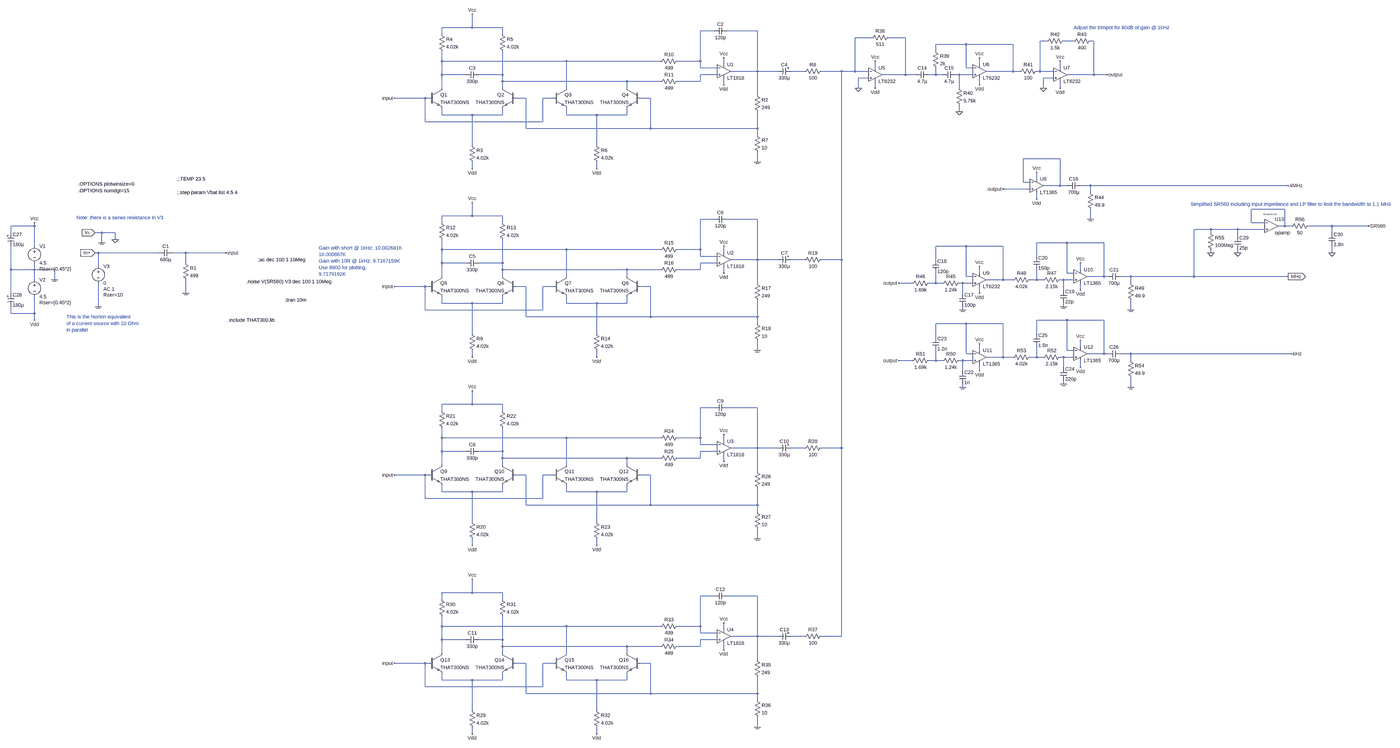
[diagram p0: schematic 60dB-LNA.asc, whole sheet]
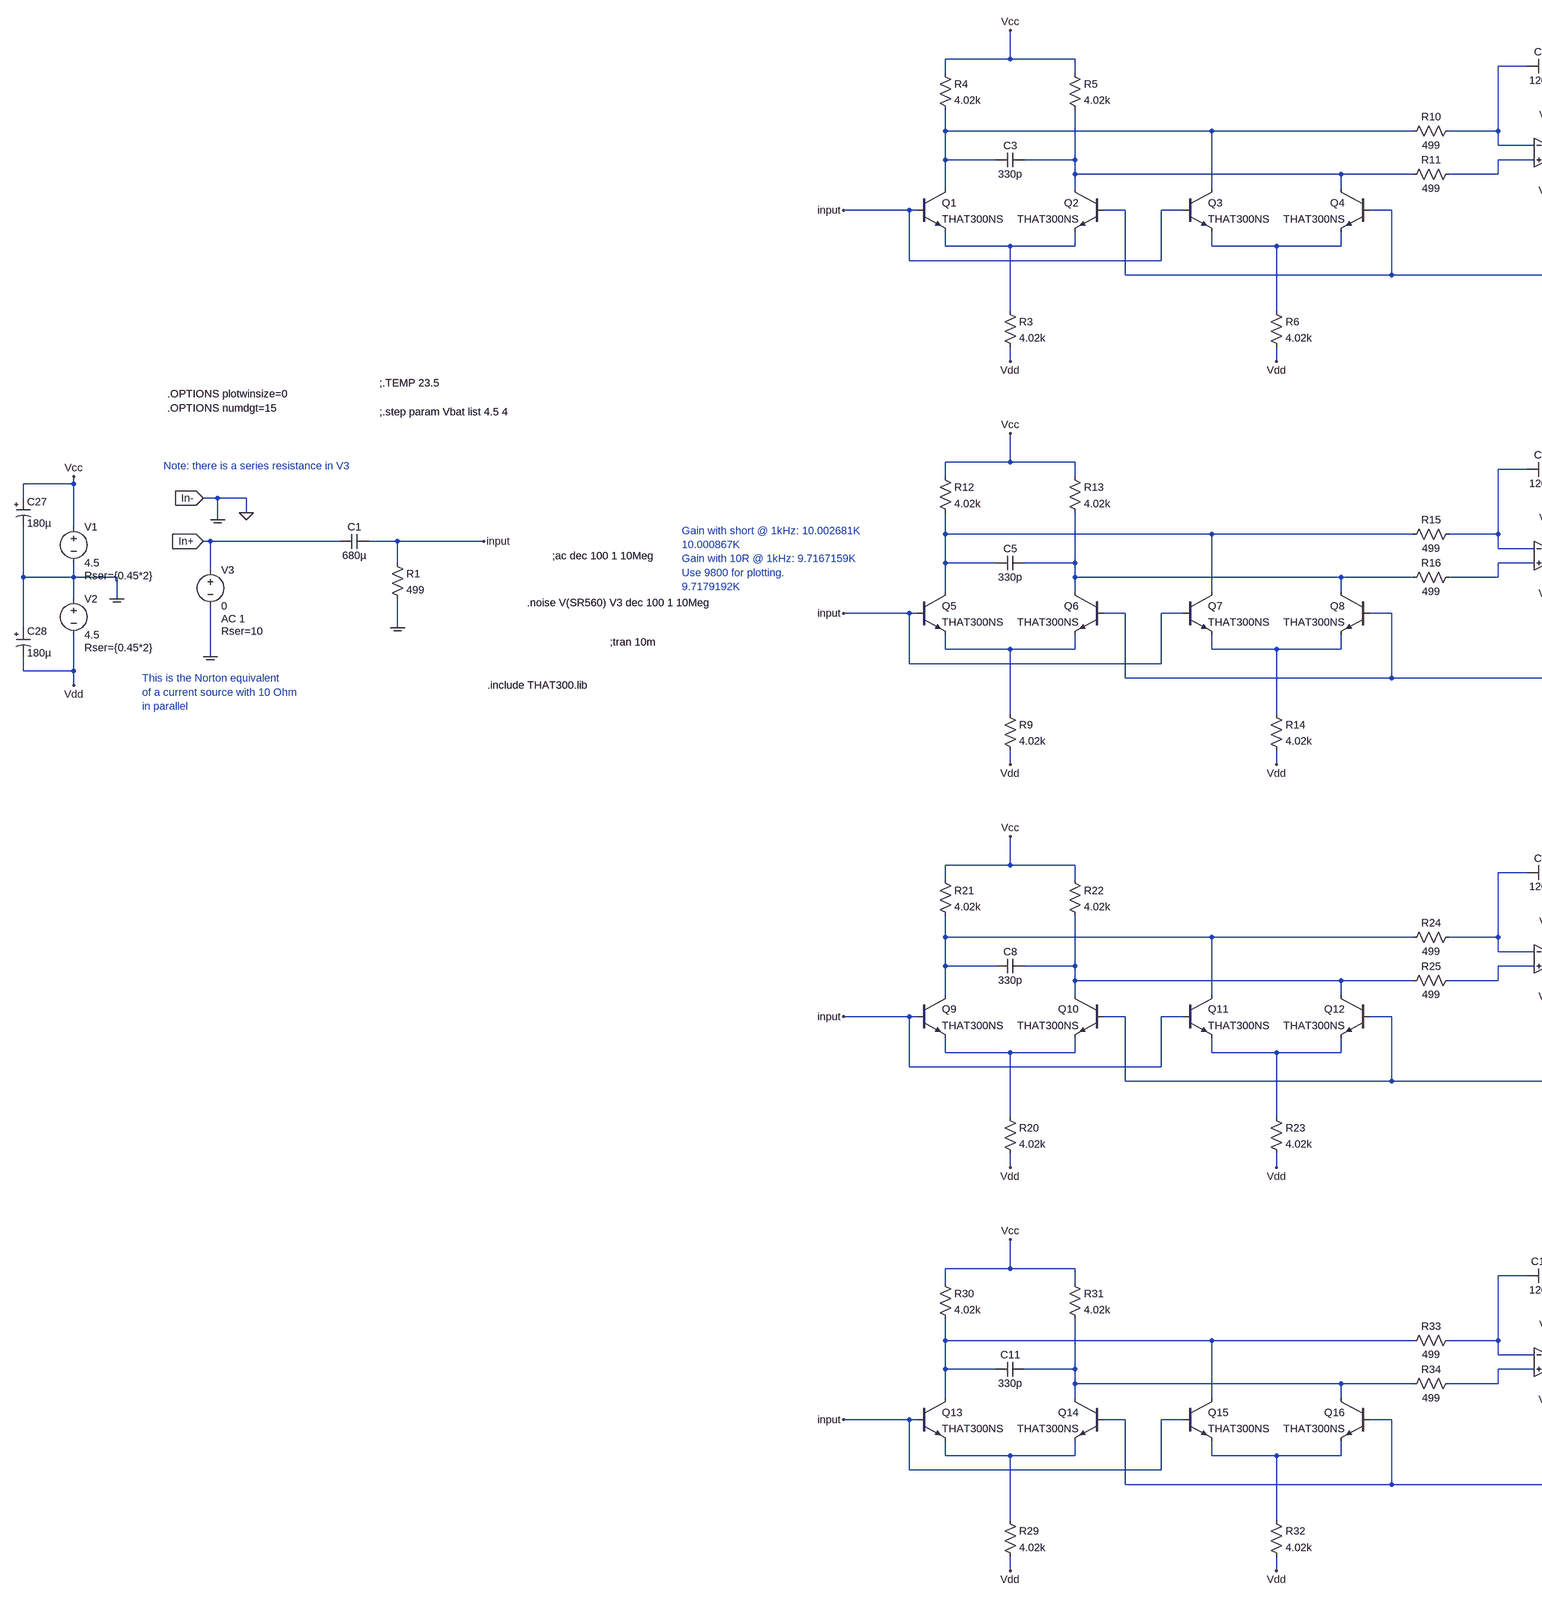
[diagram p1: schematic 60dB-LNA.asc, part, row 1 of 1, column 1 of 2]
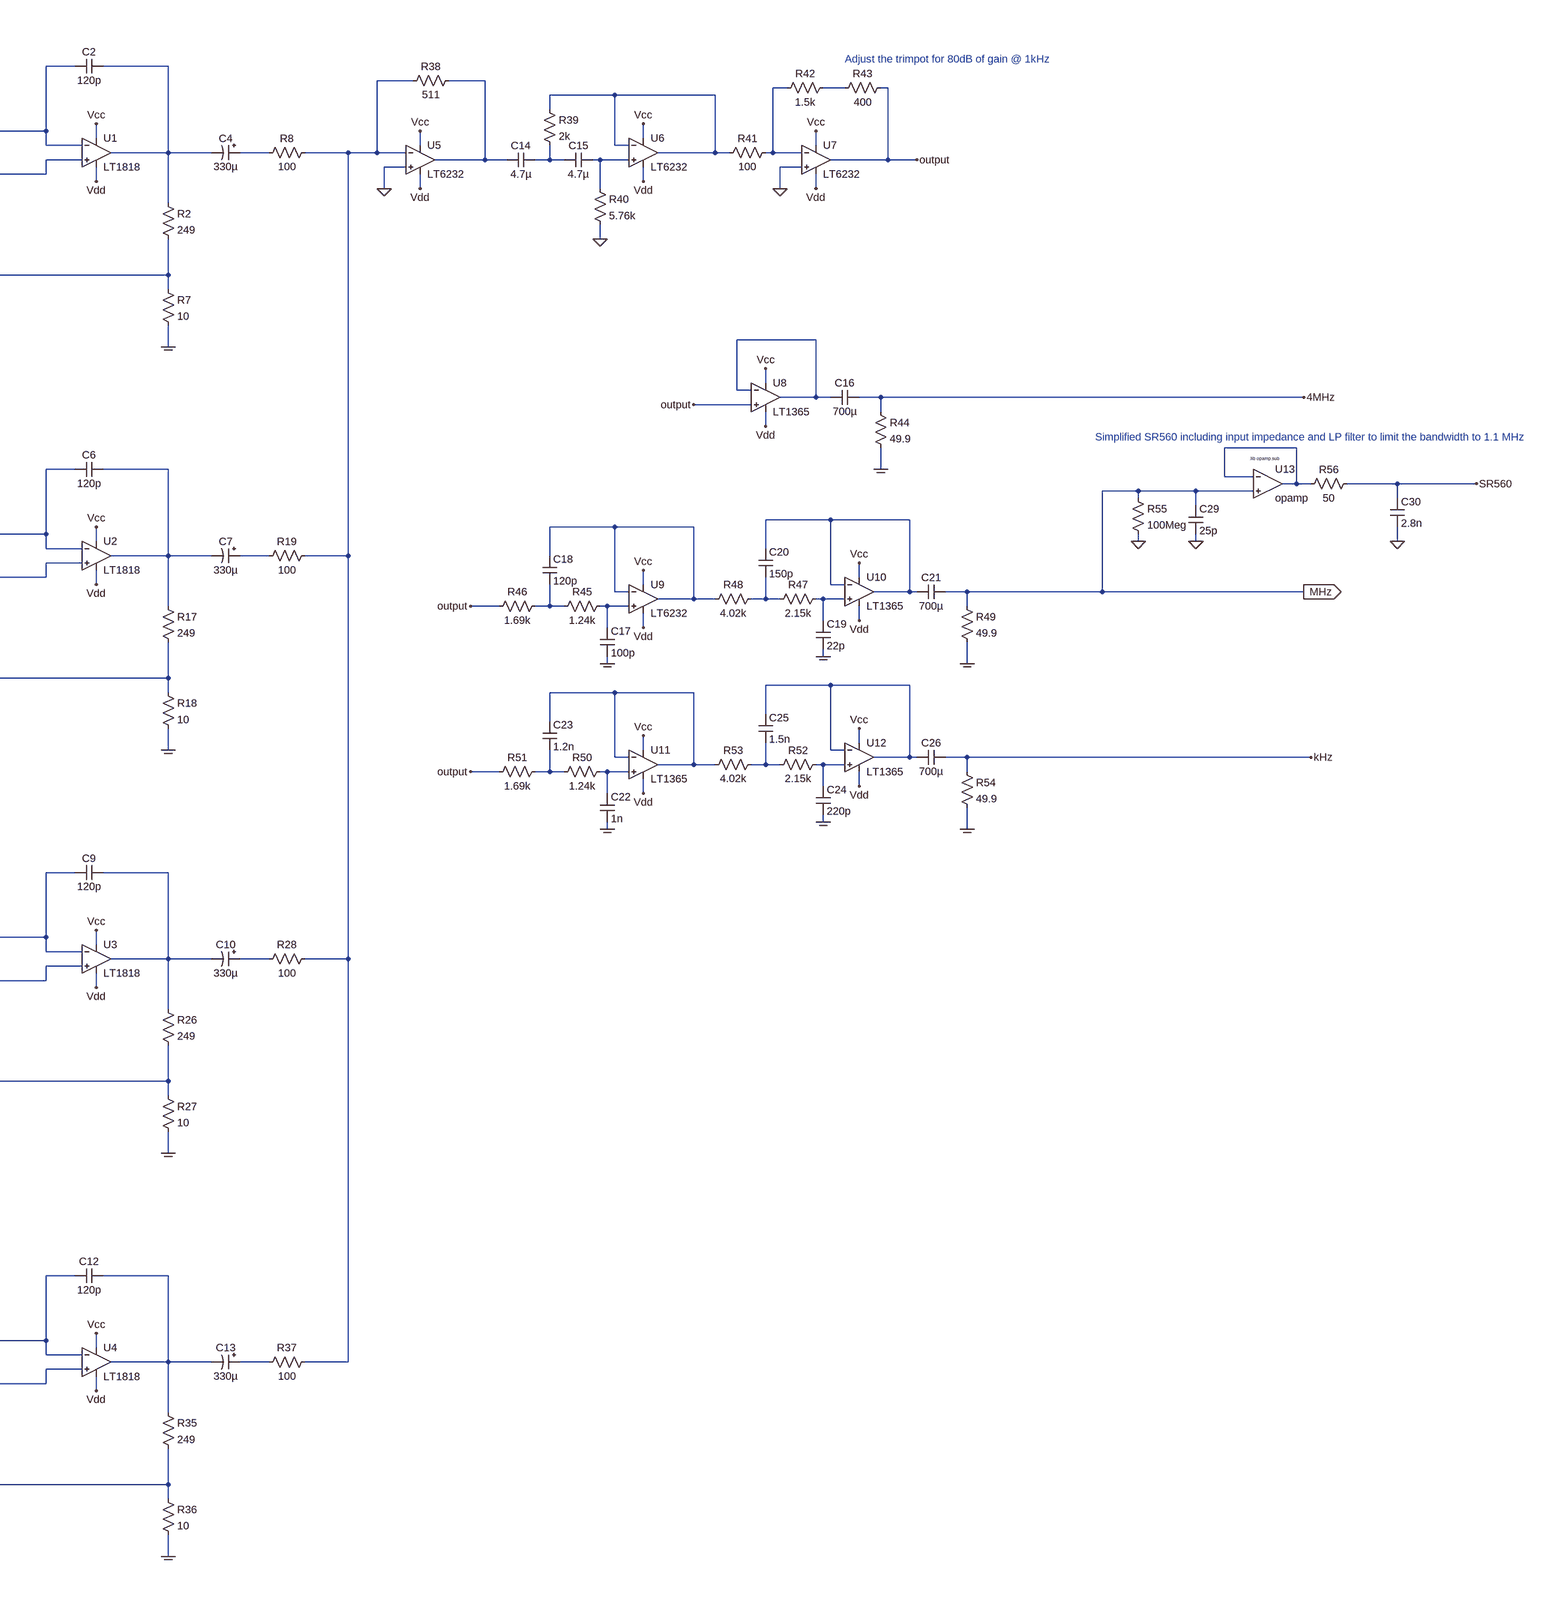
[diagram p2: schematic 60dB-LNA.asc, part, row 1 of 1, column 2 of 2]
60dB-LNA.asc, the LTspice schematic file:
Version 4
SHEET 1 5900 2380
WIRE 1408 -1072 1408 -1136
WIRE 1408 -1072 1264 -1072
WIRE 1552 -1072 1408 -1072
WIRE 2560 -1056 2496 -1056
WIRE 2768 -1056 2624 -1056
WIRE 1264 -1040 1264 -1072
WIRE 1552 -1040 1552 -1072
WIRE 3312 -1024 3232 -1024
WIRE 3472 -1024 3392 -1024
WIRE 4144 -1008 4112 -1008
WIRE 4272 -1008 4224 -1008
WIRE 4368 -1008 4352 -1008
WIRE 3760 -992 3616 -992
WIRE 3984 -992 3760 -992
WIRE 3616 -960 3616 -992
WIRE 1264 -912 1264 -960
WIRE 1856 -912 1264 -912
WIRE 2304 -912 1856 -912
WIRE 2496 -912 2496 -1056
WIRE 2496 -912 2384 -912
WIRE 2608 -896 2608 -928
WIRE 3824 -896 3824 -928
WIRE 2496 -880 2496 -912
WIRE 2576 -880 2496 -880
WIRE 3328 -880 3328 -912
WIRE 3760 -880 3760 -992
WIRE 3792 -880 3760 -880
WIRE 4208 -880 4208 -912
WIRE 2768 -864 2768 -1056
WIRE 2768 -864 2640 -864
WIRE 2864 -864 2768 -864
WIRE 2992 -864 2928 -864
WIRE 3168 -864 3072 -864
WIRE 3232 -864 3232 -1024
WIRE 3232 -864 3168 -864
WIRE 3296 -864 3232 -864
WIRE 3984 -864 3984 -992
WIRE 3984 -864 3856 -864
WIRE 4016 -864 3984 -864
WIRE 4112 -864 4112 -1008
WIRE 4112 -864 4096 -864
WIRE 4176 -864 4112 -864
WIRE 1264 -848 1264 -912
WIRE 1376 -848 1264 -848
WIRE 1552 -848 1552 -960
WIRE 1552 -848 1440 -848
WIRE 2576 -848 2496 -848
WIRE 3472 -848 3472 -1024
WIRE 3472 -848 3360 -848
WIRE 3520 -848 3472 -848
WIRE 3616 -848 3616 -880
WIRE 3616 -848 3584 -848
WIRE 3648 -848 3616 -848
WIRE 3728 -848 3712 -848
WIRE 3792 -848 3728 -848
WIRE 4368 -848 4368 -1008
WIRE 4368 -848 4240 -848
WIRE 4432 -848 4368 -848
WIRE 3296 -832 3248 -832
WIRE 4176 -832 4128 -832
WIRE 1552 -816 1552 -848
WIRE 2144 -816 1552 -816
WIRE 2304 -816 2144 -816
WIRE 2496 -816 2496 -848
WIRE 2496 -816 2384 -816
WIRE 2608 -800 2608 -832
WIRE 3824 -800 3824 -832
WIRE 1264 -784 1264 -848
WIRE 1552 -784 1552 -816
WIRE 1856 -784 1856 -912
WIRE 2144 -784 2144 -816
WIRE 3248 -784 3248 -832
WIRE 3328 -784 3328 -816
WIRE 3728 -784 3728 -848
WIRE 4128 -784 4128 -832
WIRE 4208 -784 4208 -816
WIRE 2768 -752 2768 -864
WIRE 1184 -736 976 -736
WIRE 1200 -736 1184 -736
WIRE 1664 -736 1616 -736
WIRE 1792 -736 1744 -736
WIRE 2256 -736 2208 -736
WIRE 3728 -672 3728 -704
WIRE 1264 -656 1264 -688
WIRE 1408 -656 1264 -656
WIRE 1552 -656 1552 -688
WIRE 1552 -656 1408 -656
WIRE 1856 -656 1856 -688
WIRE 2000 -656 1856 -656
WIRE 2144 -656 2144 -688
WIRE 2144 -656 2000 -656
WIRE 1184 -624 1184 -736
WIRE 1744 -624 1744 -736
WIRE 1744 -624 1184 -624
WIRE 1664 -592 1664 -736
WIRE 2256 -592 2256 -736
WIRE 2256 -592 1664 -592
WIRE 2768 -592 2768 -672
WIRE 2768 -592 2256 -592
WIRE 2768 -560 2768 -592
WIRE 1408 -512 1408 -656
WIRE 2000 -512 2000 -656
WIRE 4208 -448 4032 -448
WIRE 2768 -432 2768 -480
WIRE 1408 -400 1408 -432
WIRE 2000 -400 2000 -432
WIRE 4096 -352 4096 -384
WIRE 4032 -336 4032 -448
WIRE 4064 -336 4032 -336
WIRE 4208 -320 4208 -448
WIRE 4208 -320 4128 -320
WIRE 4240 -320 4208 -320
WIRE 4352 -320 4304 -320
WIRE 5344 -320 4352 -320
WIRE 4064 -304 3936 -304
WIRE 4352 -288 4352 -320
WIRE 4096 -256 4096 -288
WIRE 5328 -208 5168 -208
WIRE 1408 -176 1408 -240
WIRE 1408 -176 1264 -176
WIRE 1552 -176 1408 -176
WIRE 2560 -160 2496 -160
WIRE 2768 -160 2624 -160
WIRE 4352 -160 4352 -208
WIRE 1264 -144 1264 -176
WIRE 1552 -144 1552 -176
WIRE 5168 -144 5168 -208
WIRE 5232 -144 5168 -144
WIRE -736 -128 -736 -144
WIRE -736 -128 -848 -128
WIRE 5328 -128 5328 -208
WIRE 5328 -128 5296 -128
WIRE 5360 -128 5328 -128
WIRE 5552 -128 5440 -128
WIRE 5728 -128 5552 -128
WIRE 4976 -112 4896 -112
WIRE 5104 -112 4976 -112
WIRE 5232 -112 5104 -112
WIRE -848 -96 -848 -128
WIRE -416 -96 -448 -96
WIRE -352 -96 -416 -96
WIRE 4976 -96 4976 -112
WIRE 5552 -96 5552 -128
WIRE 5104 -80 5104 -112
WIRE -352 -64 -352 -96
WIRE -416 -48 -416 -96
WIRE 4240 -48 4096 -48
WIRE 4416 -48 4240 -48
WIRE -736 -32 -736 -128
WIRE 3760 -32 3616 -32
WIRE 3936 -32 3760 -32
WIRE 1264 -16 1264 -64
WIRE 1856 -16 1264 -16
WIRE 2304 -16 1856 -16
WIRE 2496 -16 2496 -160
WIRE 2496 -16 2384 -16
WIRE -432 0 -448 0
WIRE -144 0 -432 0
WIRE -16 0 -80 0
WIRE 176 0 -16 0
WIRE 2608 0 2608 -32
WIRE 4976 0 4976 -16
WIRE 5104 0 5104 -16
WIRE 5552 0 5552 -32
WIRE 2496 16 2496 -16
WIRE 2576 16 2496 16
WIRE 4096 16 4096 -48
WIRE 2768 32 2768 -160
WIRE 2768 32 2640 32
WIRE 2864 32 2768 32
WIRE 2992 32 2928 32
WIRE 3168 32 3168 -864
WIRE 3168 32 3072 32
WIRE 3616 32 3616 -32
WIRE -16 48 -16 0
WIRE 1264 48 1264 -16
WIRE 1376 48 1264 48
WIRE 1552 48 1552 -64
WIRE 1552 48 1440 48
WIRE 2576 48 2496 48
WIRE -432 64 -432 0
WIRE -848 80 -848 -32
WIRE -736 80 -736 48
WIRE -736 80 -848 80
WIRE -640 80 -736 80
WIRE 1552 80 1552 48
WIRE 2144 80 1552 80
WIRE 2304 80 2144 80
WIRE 2496 80 2496 48
WIRE 2496 80 2384 80
WIRE 4304 80 4304 48
WIRE 2608 96 2608 64
WIRE 3824 96 3824 64
WIRE 4240 96 4240 -48
WIRE 4272 96 4240 96
WIRE 1264 112 1264 48
WIRE 1552 112 1552 80
WIRE 1856 112 1856 -16
WIRE 2144 112 2144 80
WIRE 3760 112 3760 -32
WIRE 3792 112 3760 112
WIRE 4416 112 4416 -48
WIRE 4416 112 4336 112
WIRE 4432 112 4416 112
WIRE 4544 112 4496 112
WIRE 4896 112 4896 -112
WIRE 4896 112 4544 112
WIRE 5344 112 4896 112
WIRE -736 128 -736 80
WIRE -640 128 -640 80
WIRE 3936 128 3936 -32
WIRE 3936 128 3856 128
WIRE 3984 128 3936 128
WIRE 4096 128 4096 80
WIRE 4096 128 4064 128
WIRE 4128 128 4096 128
WIRE 4224 128 4208 128
WIRE 4272 128 4224 128
WIRE 2768 144 2768 32
WIRE 3504 144 3440 144
WIRE 3616 144 3616 96
WIRE 3616 144 3584 144
WIRE 3648 144 3616 144
WIRE 3744 144 3728 144
WIRE 3792 144 3744 144
WIRE 4544 144 4544 112
WIRE 1184 160 976 160
WIRE 1200 160 1184 160
WIRE 1664 160 1616 160
WIRE 1792 160 1744 160
WIRE 2256 160 2208 160
WIRE 4224 176 4224 128
WIRE 4304 176 4304 144
WIRE -848 192 -848 80
WIRE -16 192 -16 128
WIRE 3744 192 3744 144
WIRE 3824 192 3824 160
WIRE 1264 240 1264 208
WIRE 1408 240 1264 240
WIRE 1552 240 1552 208
WIRE 1552 240 1408 240
WIRE 1856 240 1856 208
WIRE 2000 240 1856 240
WIRE 2144 240 2144 208
WIRE 2144 240 2000 240
WIRE -432 256 -432 144
WIRE 4224 256 4224 240
WIRE 1184 272 1184 160
WIRE 1744 272 1744 160
WIRE 1744 272 1184 272
WIRE 3744 272 3744 256
WIRE 4544 272 4544 224
WIRE -848 288 -848 256
WIRE -736 288 -736 208
WIRE -736 288 -848 288
WIRE 1664 304 1664 160
WIRE 2256 304 2256 160
WIRE 2256 304 1664 304
WIRE 2768 304 2768 224
WIRE 2768 304 2256 304
WIRE -736 320 -736 288
WIRE 4240 320 4096 320
WIRE 4416 320 4240 320
WIRE 2768 336 2768 304
WIRE 3760 336 3616 336
WIRE 3936 336 3760 336
WIRE 1408 384 1408 240
WIRE 2000 384 2000 240
WIRE 4096 384 4096 320
WIRE 3616 400 3616 336
WIRE 4304 448 4304 416
WIRE 2768 464 2768 416
WIRE 3824 464 3824 432
WIRE 4240 464 4240 320
WIRE 4272 464 4240 464
WIRE 3760 480 3760 336
WIRE 3792 480 3760 480
WIRE 4416 480 4416 320
WIRE 4416 480 4336 480
WIRE 4432 480 4416 480
WIRE 4544 480 4496 480
WIRE 5360 480 4544 480
WIRE 1408 496 1408 464
WIRE 2000 496 2000 464
WIRE 3936 496 3936 336
WIRE 3936 496 3856 496
WIRE 3984 496 3936 496
WIRE 4096 496 4096 448
WIRE 4096 496 4064 496
WIRE 4128 496 4096 496
WIRE 4224 496 4208 496
WIRE 4272 496 4224 496
WIRE 3504 512 3440 512
WIRE 3616 512 3616 464
WIRE 3616 512 3584 512
WIRE 3648 512 3616 512
WIRE 3744 512 3728 512
WIRE 3792 512 3744 512
WIRE 4544 512 4544 480
WIRE 4224 544 4224 496
WIRE 4304 544 4304 512
WIRE 3744 560 3744 512
WIRE 3824 560 3824 528
WIRE 4224 624 4224 608
WIRE 3744 640 3744 624
WIRE 4544 640 4544 592
WIRE 1408 720 1408 656
WIRE 1408 720 1264 720
WIRE 1552 720 1408 720
WIRE 2560 736 2496 736
WIRE 2768 736 2624 736
WIRE 1264 752 1264 720
WIRE 1552 752 1552 720
WIRE 1264 880 1264 832
WIRE 1856 880 1264 880
WIRE 2304 880 1856 880
WIRE 2496 880 2496 736
WIRE 2496 880 2384 880
WIRE 2608 896 2608 864
WIRE 2496 912 2496 880
WIRE 2576 912 2496 912
WIRE 2768 928 2768 736
WIRE 2768 928 2640 928
WIRE 2864 928 2768 928
WIRE 2992 928 2928 928
WIRE 3168 928 3168 32
WIRE 3168 928 3072 928
WIRE 1264 944 1264 880
WIRE 1376 944 1264 944
WIRE 1552 944 1552 832
WIRE 1552 944 1440 944
WIRE 2576 944 2496 944
WIRE 1552 976 1552 944
WIRE 2144 976 1552 976
WIRE 2304 976 2144 976
WIRE 2496 976 2496 944
WIRE 2496 976 2384 976
WIRE 2608 992 2608 960
WIRE 1264 1008 1264 944
WIRE 1552 1008 1552 976
WIRE 1856 1008 1856 880
WIRE 2144 1008 2144 976
WIRE 2768 1040 2768 928
WIRE 1184 1056 976 1056
WIRE 1200 1056 1184 1056
WIRE 1664 1056 1616 1056
WIRE 1792 1056 1744 1056
WIRE 2256 1056 2208 1056
WIRE 1264 1136 1264 1104
WIRE 1408 1136 1264 1136
WIRE 1552 1136 1552 1104
WIRE 1552 1136 1408 1136
WIRE 1856 1136 1856 1104
WIRE 2000 1136 1856 1136
WIRE 2144 1136 2144 1104
WIRE 2144 1136 2000 1136
WIRE 1184 1168 1184 1056
WIRE 1744 1168 1744 1056
WIRE 1744 1168 1184 1168
WIRE 1664 1200 1664 1056
WIRE 2256 1200 2256 1056
WIRE 2256 1200 1664 1200
WIRE 2768 1200 2768 1120
WIRE 2768 1200 2256 1200
WIRE 2768 1232 2768 1200
WIRE 1408 1280 1408 1136
WIRE 2000 1280 2000 1136
WIRE 2768 1360 2768 1312
WIRE 1408 1392 1408 1360
WIRE 2000 1392 2000 1360
WIRE 1408 1616 1408 1552
WIRE 1408 1616 1264 1616
WIRE 1552 1616 1408 1616
WIRE 2560 1632 2496 1632
WIRE 2768 1632 2624 1632
WIRE 1264 1648 1264 1616
WIRE 1552 1648 1552 1616
WIRE 1264 1776 1264 1728
WIRE 1856 1776 1264 1776
WIRE 2304 1776 1856 1776
WIRE 2496 1776 2496 1632
WIRE 2496 1776 2384 1776
WIRE 2608 1792 2608 1760
WIRE 2496 1808 2496 1776
WIRE 2576 1808 2496 1808
WIRE 2768 1824 2768 1632
WIRE 2768 1824 2640 1824
WIRE 2864 1824 2768 1824
WIRE 2992 1824 2928 1824
WIRE 3168 1824 3168 928
WIRE 3168 1824 3072 1824
WIRE 1264 1840 1264 1776
WIRE 1376 1840 1264 1840
WIRE 1552 1840 1552 1728
WIRE 1552 1840 1440 1840
WIRE 2576 1840 2496 1840
WIRE 1552 1872 1552 1840
WIRE 2144 1872 1552 1872
WIRE 2304 1872 2144 1872
WIRE 2496 1872 2496 1840
WIRE 2496 1872 2384 1872
WIRE 2608 1888 2608 1856
WIRE 1264 1904 1264 1840
WIRE 1552 1904 1552 1872
WIRE 1856 1904 1856 1776
WIRE 2144 1904 2144 1872
WIRE 2768 1936 2768 1824
WIRE 1184 1952 976 1952
WIRE 1200 1952 1184 1952
WIRE 1664 1952 1616 1952
WIRE 1792 1952 1744 1952
WIRE 2256 1952 2208 1952
WIRE 1264 2032 1264 2000
WIRE 1408 2032 1264 2032
WIRE 1552 2032 1552 2000
WIRE 1552 2032 1408 2032
WIRE 1856 2032 1856 2000
WIRE 2000 2032 1856 2032
WIRE 2144 2032 2144 2000
WIRE 2144 2032 2000 2032
WIRE 1184 2064 1184 1952
WIRE 1744 2064 1744 1952
WIRE 1744 2064 1184 2064
WIRE 1664 2096 1664 1952
WIRE 2256 2096 2256 1952
WIRE 2256 2096 1664 2096
WIRE 2768 2096 2768 2016
WIRE 2768 2096 2256 2096
WIRE 2768 2128 2768 2096
WIRE 1408 2176 1408 2032
WIRE 2000 2176 2000 2032
WIRE 2768 2256 2768 2208
WIRE 1408 2288 1408 2256
WIRE 2000 2288 2000 2256
FLAG -640 128 COM
FLAG -736 -144 Vcc
FLAG -736 320 Vdd
FLAG 1408 -1136 Vcc
FLAG 1408 -400 Vdd
FLAG 2000 -400 Vdd
FLAG -432 256 COM
FLAG 2608 -928 Vcc
FLAG 2608 -800 Vdd
FLAG -16 192 COM
FLAG 2768 -432 COM
FLAG 176 0 input
FLAG 976 -736 input
FLAG 1408 -240 Vcc
FLAG 1408 496 Vdd
FLAG 2000 496 Vdd
FLAG 2608 -32 Vcc
FLAG 2608 96 Vdd
FLAG 2768 464 COM
FLAG 976 160 input
FLAG 1408 656 Vcc
FLAG 1408 1392 Vdd
FLAG 2000 1392 Vdd
FLAG 2608 864 Vcc
FLAG 2608 992 Vdd
FLAG 2768 1360 COM
FLAG 976 1056 input
FLAG 1408 1552 Vcc
FLAG 1408 2288 Vdd
FLAG 2000 2288 Vdd
FLAG 2608 1760 Vcc
FLAG 2608 1888 Vdd
FLAG 2768 2256 COM
FLAG 976 1952 input
FLAG 3328 -912 Vcc
FLAG 3328 -784 Vdd
FLAG 3248 -784 0
FLAG 3824 -928 Vcc
FLAG 3824 -800 Vdd
FLAG 3728 -672 0
FLAG 4208 -912 Vcc
FLAG 4208 -784 Vdd
FLAG 4128 -784 0
FLAG 4432 -848 output
FLAG 3936 -304 output
FLAG 3440 144 output
FLAG 4352 -160 COM
FLAG 4096 -384 Vcc
FLAG 4096 -256 Vdd
FLAG 3824 64 Vcc
FLAG 3824 192 Vdd
FLAG 3744 272 COM
FLAG 4304 48 Vcc
FLAG 4304 176 Vdd
FLAG 4224 256 COM
FLAG 4544 272 COM
FLAG 3440 512 output
FLAG 3824 432 Vcc
FLAG 3824 560 Vdd
FLAG 3744 640 COM
FLAG 4304 416 Vcc
FLAG 4304 544 Vdd
FLAG 4224 624 COM
FLAG 4544 640 COM
FLAG -448 0 In+
IOPIN -448 0 In
FLAG -448 -96 In-
IOPIN -448 -96 In
FLAG -416 -48 COM
FLAG -352 -64 0
FLAG 5344 -320 4MHz
FLAG 5360 480 kHz
FLAG 5344 112 MHz
IOPIN 5344 112 Out
FLAG 5728 -128 SR560
FLAG 5552 0 0
FLAG 4976 0 0
FLAG 5104 0 0
SYMBOL cap -80 -16 R90
WINDOW 0 0 32 VBottom 2
WINDOW 3 32 32 VTop 2
SYMATTR InstName C1
SYMATTR Value 680µ
SYMBOL res 1392 -528 R0
SYMATTR InstName R3
SYMATTR Value 4.02k
SYMBOL res 1248 -1056 R0
SYMATTR InstName R4
SYMATTR Value 4.02k
SYMBOL res 1536 -1056 R0
SYMATTR InstName R5
SYMATTR Value 4.02k
SYMBOL res 1984 -528 R0
SYMATTR InstName R6
SYMATTR Value 4.02k
SYMBOL voltage -736 -48 R0
WINDOW 123 0 0 Left 2
WINDOW 39 24 124 Left 2
SYMATTR SpiceLine Rser={0.45*2}
SYMATTR InstName V1
SYMATTR Value 4.5
SYMBOL voltage -736 112 R0
WINDOW 123 0 0 Left 2
WINDOW 39 24 124 Left 2
SYMATTR SpiceLine Rser={0.45*2}
SYMATTR InstName V2
SYMATTR Value 4.5
SYMBOL voltage -432 48 R0
WINDOW 123 24 124 Left 2
WINDOW 39 24 152 Left 2
SYMATTR Value2 AC 1
SYMATTR SpiceLine Rser=10
SYMATTR InstName V3
SYMATTR Value 0
SYMBOL res 2400 -928 R90
WINDOW 0 0 56 VBottom 2
WINDOW 3 32 56 VTop 2
SYMATTR InstName R10
SYMATTR Value 499
SYMBOL res 2400 -832 R90
WINDOW 0 0 56 VBottom 2
WINDOW 3 32 56 VTop 2
SYMATTR InstName R11
SYMATTR Value 499
SYMBOL res -32 32 R0
SYMATTR InstName R1
SYMATTR Value 499
SYMBOL npn 1200 -784 R0
SYMATTR InstName Q1
SYMATTR Value THAT300NS
SYMBOL npn 1616 -784 M0
SYMATTR InstName Q2
SYMATTR Value THAT300NS
SYMBOL npn 1792 -784 R0
SYMATTR InstName Q3
SYMATTR Value THAT300NS
SYMBOL npn 2208 -784 M0
SYMATTR InstName Q4
SYMATTR Value THAT300NS
SYMBOL cap 1440 -864 R90
WINDOW 0 0 32 VBottom 2
WINDOW 3 32 32 VTop 2
SYMATTR InstName C3
SYMATTR Value 330p
SYMBOL Opamps\\LT1818 2608 -864 R0
SYMATTR InstName U1
SYMBOL cap 2624 -1072 R90
WINDOW 0 0 32 VBottom 2
WINDOW 3 32 32 VTop 2
SYMATTR InstName C2
SYMATTR Value 120p
SYMBOL res 2752 -768 R0
SYMATTR InstName R2
SYMATTR Value 249
SYMBOL res 2752 -576 R0
SYMATTR InstName R7
SYMATTR Value 10
SYMBOL polcap 2928 -880 R90
WINDOW 0 0 32 VBottom 2
WINDOW 3 32 32 VTop 2
SYMATTR InstName C4
SYMATTR Value 330µ
SYMATTR Description Capacitor
SYMATTR Type cap
SYMATTR SpiceLine V=10 Irms=4.90917 Rser=0.01 Lser=0 mfg="KEMET" pn="T520Y337M010ATE010" type="Tantalum"
SYMBOL res 3088 -880 R90
WINDOW 0 0 56 VBottom 2
WINDOW 3 32 56 VTop 2
SYMATTR InstName R8
SYMATTR Value 100
SYMBOL res 1392 368 R0
SYMATTR InstName R9
SYMATTR Value 4.02k
SYMBOL res 1248 -160 R0
SYMATTR InstName R12
SYMATTR Value 4.02k
SYMBOL res 1536 -160 R0
SYMATTR InstName R13
SYMATTR Value 4.02k
SYMBOL res 1984 368 R0
SYMATTR InstName R14
SYMATTR Value 4.02k
SYMBOL res 2400 -32 R90
WINDOW 0 0 56 VBottom 2
WINDOW 3 32 56 VTop 2
SYMATTR InstName R15
SYMATTR Value 499
SYMBOL res 2400 64 R90
WINDOW 0 0 56 VBottom 2
WINDOW 3 32 56 VTop 2
SYMATTR InstName R16
SYMATTR Value 499
SYMBOL npn 1200 112 R0
SYMATTR InstName Q5
SYMATTR Value THAT300NS
SYMBOL npn 1616 112 M0
SYMATTR InstName Q6
SYMATTR Value THAT300NS
SYMBOL npn 1792 112 R0
SYMATTR InstName Q7
SYMATTR Value THAT300NS
SYMBOL npn 2208 112 M0
SYMATTR InstName Q8
SYMATTR Value THAT300NS
SYMBOL cap 1440 32 R90
WINDOW 0 0 32 VBottom 2
WINDOW 3 32 32 VTop 2
SYMATTR InstName C5
SYMATTR Value 330p
SYMBOL Opamps\\LT1818 2608 32 R0
SYMATTR InstName U2
SYMBOL cap 2624 -176 R90
WINDOW 0 0 32 VBottom 2
WINDOW 3 32 32 VTop 2
SYMATTR InstName C6
SYMATTR Value 120p
SYMBOL res 2752 128 R0
SYMATTR InstName R17
SYMATTR Value 249
SYMBOL res 2752 320 R0
SYMATTR InstName R18
SYMATTR Value 10
SYMBOL polcap 2928 16 R90
WINDOW 0 0 32 VBottom 2
WINDOW 3 32 32 VTop 2
SYMATTR InstName C7
SYMATTR Value 330µ
SYMATTR Description Capacitor
SYMATTR Type cap
SYMATTR SpiceLine V=10 Irms=4.90917 Rser=0.01 Lser=0 mfg="KEMET" pn="T520Y337M010ATE010" type="Tantalum"
SYMBOL res 3088 16 R90
WINDOW 0 0 56 VBottom 2
WINDOW 3 32 56 VTop 2
SYMATTR InstName R19
SYMATTR Value 100
SYMBOL res 1392 1264 R0
SYMATTR InstName R20
SYMATTR Value 4.02k
SYMBOL res 1248 736 R0
SYMATTR InstName R21
SYMATTR Value 4.02k
SYMBOL res 1536 736 R0
SYMATTR InstName R22
SYMATTR Value 4.02k
SYMBOL res 1984 1264 R0
SYMATTR InstName R23
SYMATTR Value 4.02k
SYMBOL res 2400 864 R90
WINDOW 0 0 56 VBottom 2
WINDOW 3 32 56 VTop 2
SYMATTR InstName R24
SYMATTR Value 499
SYMBOL res 2400 960 R90
WINDOW 0 0 56 VBottom 2
WINDOW 3 32 56 VTop 2
SYMATTR InstName R25
SYMATTR Value 499
SYMBOL npn 1200 1008 R0
SYMATTR InstName Q9
SYMATTR Value THAT300NS
SYMBOL npn 1616 1008 M0
SYMATTR InstName Q10
SYMATTR Value THAT300NS
SYMBOL npn 1792 1008 R0
SYMATTR InstName Q11
SYMATTR Value THAT300NS
SYMBOL npn 2208 1008 M0
SYMATTR InstName Q12
SYMATTR Value THAT300NS
SYMBOL cap 1440 928 R90
WINDOW 0 0 32 VBottom 2
WINDOW 3 32 32 VTop 2
SYMATTR InstName C8
SYMATTR Value 330p
SYMBOL Opamps\\LT1818 2608 928 R0
SYMATTR InstName U3
SYMBOL cap 2624 720 R90
WINDOW 0 0 32 VBottom 2
WINDOW 3 32 32 VTop 2
SYMATTR InstName C9
SYMATTR Value 120p
SYMBOL res 2752 1024 R0
SYMATTR InstName R26
SYMATTR Value 249
SYMBOL res 2752 1216 R0
SYMATTR InstName R27
SYMATTR Value 10
SYMBOL polcap 2928 912 R90
WINDOW 0 0 32 VBottom 2
WINDOW 3 32 32 VTop 2
SYMATTR InstName C10
SYMATTR Value 330µ
SYMATTR Description Capacitor
SYMATTR Type cap
SYMATTR SpiceLine V=10 Irms=4.90917 Rser=0.01 Lser=0 mfg="KEMET" pn="T520Y337M010ATE010" type="Tantalum"
SYMBOL res 3088 912 R90
WINDOW 0 0 56 VBottom 2
WINDOW 3 32 56 VTop 2
SYMATTR InstName R28
SYMATTR Value 100
SYMBOL res 1392 2160 R0
SYMATTR InstName R29
SYMATTR Value 4.02k
SYMBOL res 1248 1632 R0
SYMATTR InstName R30
SYMATTR Value 4.02k
SYMBOL res 1536 1632 R0
SYMATTR InstName R31
SYMATTR Value 4.02k
SYMBOL res 1984 2160 R0
SYMATTR InstName R32
SYMATTR Value 4.02k
SYMBOL res 2400 1760 R90
WINDOW 0 0 56 VBottom 2
WINDOW 3 32 56 VTop 2
SYMATTR InstName R33
SYMATTR Value 499
SYMBOL res 2400 1856 R90
WINDOW 0 0 56 VBottom 2
WINDOW 3 32 56 VTop 2
SYMATTR InstName R34
SYMATTR Value 499
SYMBOL npn 1200 1904 R0
SYMATTR InstName Q13
SYMATTR Value THAT300NS
SYMBOL npn 1616 1904 M0
SYMATTR InstName Q14
SYMATTR Value THAT300NS
SYMBOL npn 1792 1904 R0
SYMATTR InstName Q15
SYMATTR Value THAT300NS
SYMBOL npn 2208 1904 M0
SYMATTR InstName Q16
SYMATTR Value THAT300NS
SYMBOL cap 1440 1824 R90
WINDOW 0 0 32 VBottom 2
WINDOW 3 32 32 VTop 2
SYMATTR InstName C11
SYMATTR Value 330p
SYMBOL Opamps\\LT1818 2608 1824 R0
SYMATTR InstName U4
SYMBOL cap 2624 1616 R90
WINDOW 0 0 32 VBottom 2
WINDOW 3 32 32 VTop 2
SYMATTR InstName C12
SYMATTR Value 120p
SYMBOL res 2752 1920 R0
SYMATTR InstName R35
SYMATTR Value 249
SYMBOL res 2752 2112 R0
SYMATTR InstName R36
SYMATTR Value 10
SYMBOL polcap 2928 1808 R90
WINDOW 0 0 32 VBottom 2
WINDOW 3 32 32 VTop 2
SYMATTR InstName C13
SYMATTR Value 330µ
SYMATTR Description Capacitor
SYMATTR Type cap
SYMATTR SpiceLine V=10 Irms=4.90917 Rser=0.01 Lser=0 mfg="KEMET" pn="T520Y337M010ATE010" type="Tantalum"
SYMBOL res 3088 1808 R90
WINDOW 0 0 56 VBottom 2
WINDOW 3 32 56 VTop 2
SYMATTR InstName R37
SYMATTR Value 100
SYMBOL Opamps\\LT6232 3328 -848 R0
SYMATTR InstName U5
SYMBOL res 3408 -1040 R90
WINDOW 0 0 56 VBottom 2
WINDOW 3 32 56 VTop 2
SYMATTR InstName R38
SYMATTR Value 511
SYMBOL Opamps\\LT6232 3824 -864 R0
SYMATTR InstName U6
SYMBOL cap 3584 -864 R90
WINDOW 0 0 32 VBottom 2
WINDOW 3 32 32 VTop 2
SYMATTR InstName C14
SYMATTR Value 4.7µ
SYMBOL cap 3712 -864 R90
WINDOW 0 0 32 VBottom 2
WINDOW 3 32 32 VTop 2
SYMATTR InstName C15
SYMATTR Value 4.7µ
SYMBOL res 3600 -976 R0
SYMATTR InstName R39
SYMATTR Value 2k
SYMBOL res 3712 -800 R0
SYMATTR InstName R40
SYMATTR Value 5.76k
SYMBOL res 4112 -880 R90
WINDOW 0 0 56 VBottom 2
WINDOW 3 32 56 VTop 2
SYMATTR InstName R41
SYMATTR Value 100
SYMBOL Opamps\\LT6232 4208 -848 R0
SYMATTR InstName U7
SYMBOL res 4240 -1024 R90
WINDOW 0 0 56 VBottom 2
WINDOW 3 32 56 VTop 2
SYMATTR InstName R42
SYMATTR Value 1.5k
SYMBOL res 4368 -1024 R90
WINDOW 0 0 56 VBottom 2
WINDOW 3 32 56 VTop 2
SYMATTR InstName R43
SYMATTR Value 400
SYMBOL Opamps\\LT1365 4096 -384 R0
SYMATTR InstName U8
SYMBOL cap 4304 -336 R90
WINDOW 0 0 32 VBottom 2
WINDOW 3 32 32 VTop 2
SYMATTR InstName C16
SYMATTR Value 700µ
SYMBOL res 4336 -304 R0
SYMATTR InstName R44
SYMATTR Value 49.9
SYMBOL Opamps\\LT6232 3824 128 R0
SYMATTR InstName U9
SYMBOL res 3744 128 R90
WINDOW 0 0 56 VBottom 2
WINDOW 3 32 56 VTop 2
SYMATTR InstName R45
SYMATTR Value 1.24k
SYMBOL res 3600 128 R90
WINDOW 0 0 56 VBottom 2
WINDOW 3 32 56 VTop 2
SYMATTR InstName R46
SYMATTR Value 1.69k
SYMBOL cap 3728 192 R0
SYMATTR InstName C17
SYMATTR Value 100p
SYMBOL cap 3600 32 R0
SYMATTR InstName C18
SYMATTR Value 120p
SYMBOL res 4224 112 R90
WINDOW 0 0 56 VBottom 2
WINDOW 3 32 56 VTop 2
SYMATTR InstName R47
SYMATTR Value 2.15k
SYMBOL res 4080 112 R90
WINDOW 0 0 56 VBottom 2
WINDOW 3 32 56 VTop 2
SYMATTR InstName R48
SYMATTR Value 4.02k
SYMBOL cap 4208 176 R0
SYMATTR InstName C19
SYMATTR Value 22p
SYMBOL cap 4080 16 R0
SYMATTR InstName C20
SYMATTR Value 150p
SYMBOL cap 4496 96 R90
WINDOW 0 0 32 VBottom 2
WINDOW 3 32 32 VTop 2
SYMATTR InstName C21
SYMATTR Value 700µ
SYMBOL res 4528 128 R0
SYMATTR InstName R49
SYMATTR Value 49.9
SYMBOL Opamps\\LT1365 4304 48 R0
SYMATTR InstName U10
SYMBOL res 3744 496 R90
WINDOW 0 0 56 VBottom 2
WINDOW 3 32 56 VTop 2
SYMATTR InstName R50
SYMATTR Value 1.24k
SYMBOL res 3600 496 R90
WINDOW 0 0 56 VBottom 2
WINDOW 3 32 56 VTop 2
SYMATTR InstName R51
SYMATTR Value 1.69k
SYMBOL cap 3728 560 R0
SYMATTR InstName C22
SYMATTR Value 1n
SYMBOL cap 3600 400 R0
SYMATTR InstName C23
SYMATTR Value 1.2n
SYMBOL res 4224 480 R90
WINDOW 0 0 56 VBottom 2
WINDOW 3 32 56 VTop 2
SYMATTR InstName R52
SYMATTR Value 2.15k
SYMBOL res 4080 480 R90
WINDOW 0 0 56 VBottom 2
WINDOW 3 32 56 VTop 2
SYMATTR InstName R53
SYMATTR Value 4.02k
SYMBOL cap 4208 544 R0
SYMATTR InstName C24
SYMATTR Value 220p
SYMBOL cap 4080 384 R0
SYMATTR InstName C25
SYMATTR Value 1.5n
SYMBOL cap 4496 464 R90
WINDOW 0 0 32 VBottom 2
WINDOW 3 32 32 VTop 2
SYMATTR InstName C26
SYMATTR Value 700µ
SYMBOL res 4528 496 R0
SYMATTR InstName R54
SYMATTR Value 49.9
SYMBOL Opamps\\LT1365 4304 416 R0
SYMATTR InstName U12
SYMBOL Opamps\\LT1365 3824 432 R0
SYMATTR InstName U11
SYMBOL polcap -864 -96 R0
WINDOW 3 24 56 Left 2
SYMATTR Value 180µ
SYMATTR InstName C27
SYMATTR Description Capacitor
SYMATTR Type cap
SYMATTR SpiceLine V=25 Irms=3 Rser=0.016 Lser=0
SYMBOL polcap -864 192 R0
WINDOW 3 24 56 Left 2
SYMATTR Value 180µ
SYMATTR InstName C28
SYMATTR Description Capacitor
SYMATTR Type cap
SYMATTR SpiceLine V=25 Irms=3 Rser=0.016 Lser=0
SYMBOL res 4960 -112 R0
SYMATTR InstName R55
SYMATTR Value 100Meg
SYMBOL cap 5088 -80 R0
SYMATTR InstName C29
SYMATTR Value 25p
SYMBOL res 5456 -144 R90
WINDOW 0 0 56 VBottom 2
WINDOW 3 32 56 VTop 2
SYMATTR InstName R56
SYMATTR Value 50
SYMBOL cap 5536 -96 R0
SYMATTR InstName C30
SYMATTR Value 2.8n
SYMBOL OpAmps\\opamp 5264 -192 R0
SYMATTR InstName U13
SYMATTR SpiceLine Aol=100G
SYMATTR SpiceLine2 GBW=100Meg
TEXT 272 136 Left 2 !.noise V(SR560) V3 dec 100 1 10Meg
TEXT 184 320 Left 2 !.include THAT300.lib
TEXT 456 224 Left 2 !;tran 10m
TEXT -528 -328 Left 2 !.OPTIONS plotwinsize=0
TEXT -528 -296 Left 2 !.OPTIONS numdgt=15
TEXT 4272 -1072 Left 2 ;Adjust the trimpot for 80dB of gain @ 1kHz
TEXT 328 32 Left 2 !;ac dec 100 1 10Meg
TEXT -536 -168 Left 2 ;Note: there is a series resistance in V3
TEXT -56 -352 Left 2 !;.TEMP 23.5
TEXT -56 -288 Left 2 !;.step param Vbat list 4.5 4
TEXT -584 304 Left 2 ;This is the Norton equivalent\nof a current source with 10 Ohm\nin parallel
TEXT 616 -24 Left 2 ;Gain with short @ 1kHz: 10.002681K\n10.000867K\nGain with 10R @ 1kHz: 9.7167159K\nUse 9800 for plotting.\n9.7179192K
TEXT 5224 -184 Left 0 !.lib opamp.sub
TEXT 4880 -232 Left 2 ;Simplified SR560 including input impedance and LP filter to limit the bandwidth to 1.1 MHz

The netlist it stands for:
* 60dB-LNA.asc
C1 input In+ 680µ
R3 N015 Vdd 4.02k
R4 Vcc N008 4.02k
R5 Vcc N010 4.02k
R6 N016 Vdd 4.02k
V1 Vcc 0 4.5 Rser={0.45*2}
V2 0 Vdd 4.5 Rser={0.45*2}
V3 In+ 0 0 AC 1 Rser=10
R10 N001 N008 499
R11 N011 N010 499
R1 input 0 499
Q1 N008 input N015 0 THAT300NS
Q2 N010 N014 N015 0 THAT300NS
Q3 N008 input N016 0 THAT300NS
Q4 N010 N014 N016 0 THAT300NS
C3 N010 N008 330p
XU1 N011 N001 N002 Vcc Vdd LT1818  ; pins In+ In- OUT V+ V-
C2 N002 N001 120p
R2 N002 N014 249
R7 N014 0 10
C4 N009 N002 330µ V=10 Irms=4.90917 Rser=0.01 Lser=0 mfg="KEMET" pn="T520Y337M010ATE010" type="Tantalum"
R8 N003 N009 100
R9 N032 Vdd 4.02k
R12 Vcc N023 4.02k
R13 Vcc N025 4.02k
R14 N033 Vdd 4.02k
R15 N019 N023 499
R16 N026 N025 499
Q5 N023 input N032 0 THAT300NS
Q6 N025 N031 N032 0 THAT300NS
Q7 N023 input N033 0 THAT300NS
Q8 N025 N031 N033 0 THAT300NS
C5 N025 N023 330p
XU2 N026 N019 N020 Vcc Vdd LT1818  ; pins In+ In- OUT V+ V-
C6 N020 N019 120p
R17 N020 N031 249
R18 N031 0 10
C7 N024 N020 330µ V=10 Irms=4.90917 Rser=0.01 Lser=0 mfg="KEMET" pn="T520Y337M010ATE010" type="Tantalum"
R19 N003 N024 100
R20 N047 Vdd 4.02k
R21 Vcc N042 4.02k
R22 Vcc N044 4.02k
R23 N048 Vdd 4.02k
R24 N040 N042 499
R25 N045 N044 499
Q9 N042 input N047 0 THAT300NS
Q10 N044 N046 N047 0 THAT300NS
Q11 N042 input N048 0 THAT300NS
Q12 N044 N046 N048 0 THAT300NS
C8 N044 N042 330p
XU3 N045 N040 N041 Vcc Vdd LT1818  ; pins In+ In- OUT V+ V-
C9 N041 N040 120p
R26 N041 N046 249
R27 N046 0 10
C10 N043 N041 330µ V=10 Irms=4.90917 Rser=0.01 Lser=0 mfg="KEMET" pn="T520Y337M010ATE010" type="Tantalum"
R28 N003 N043 100
R29 N056 Vdd 4.02k
R30 Vcc N051 4.02k
R31 Vcc N053 4.02k
R32 N057 Vdd 4.02k
R33 N049 N051 499
R34 N054 N053 499
Q13 N051 input N056 0 THAT300NS
Q14 N053 N055 N056 0 THAT300NS
Q15 N051 input N057 0 THAT300NS
Q16 N053 N055 N057 0 THAT300NS
C11 N053 N051 330p
XU4 N054 N049 N050 Vcc Vdd LT1818  ; pins In+ In- OUT V+ V-
C12 N050 N049 120p
R35 N050 N055 249
R36 N055 0 10
C13 N052 N050 330µ V=10 Irms=4.90917 Rser=0.01 Lser=0 mfg="KEMET" pn="T520Y337M010ATE010" type="Tantalum"
R37 N003 N052 100
* U5: LT6232 (symbol Opamps\LT6232 not available, pins judged from their places): In+=0 In-=N003 V+=Vcc V-=Vdd OUT=N004
R38 N004 N003 511
* U6: LT6232 (symbol Opamps\LT6232 not available, pins judged from their places): In+=N013 In-=N007 V+=Vcc V-=Vdd OUT=N007
C14 N012 N004 4.7µ
C15 N013 N012 4.7µ
R39 N007 N012 2k
R40 N013 0 5.76k
R41 N005 N007 100
* U7: LT6232 (symbol Opamps\LT6232 not available, pins judged from their places): In+=0 In-=N005 V+=Vcc V-=Vdd OUT=output
R42 N006 N005 1.5k
R43 output N006 400
XU8 output N017 Vcc Vdd N017 LT1365  ; pins In+ In- V+ V- OUT
C16 4MHz N017 700µ
R44 4MHz 0 49.9
* U9: LT6232 (symbol Opamps\LT6232 not available, pins judged from their places): In+=N030 In-=N022 V+=Vcc V-=Vdd OUT=N022
R45 N030 N029 1.24k
R46 N029 output 1.69k
C17 N030 0 100p
C18 N022 N029 120p
R47 N028 N027 2.15k
R48 N027 N022 4.02k
C19 N028 0 22p
C20 N021 N027 150p
C21 MHz N021 700µ
R49 MHz 0 49.9
XU10 N028 N021 Vcc Vdd N021 LT1365  ; pins In+ In- V+ V- OUT
R50 N039 N038 1.24k
R51 N038 output 1.69k
C22 N039 0 1n
C23 N035 N038 1.2n
R52 N037 N036 2.15k
R53 N036 N035 4.02k
C24 N037 0 220p
C25 N034 N036 1.5n
C26 kHz N034 700µ
R54 kHz 0 49.9
XU12 N037 N034 Vcc Vdd N034 LT1365  ; pins In+ In- V+ V- OUT
XU11 N039 N035 Vcc Vdd N035 LT1365  ; pins In+ In- V+ V- OUT
C27 Vcc 0 180µ V=25 Irms=3 Rser=0.016 Lser=0
C28 0 Vdd 180µ V=25 Irms=3 Rser=0.016 Lser=0
R55 MHz 0 100Meg
C29 MHz 0 25p
R56 SR560 N018 50
C30 SR560 0 2.8n
XU13 N018 MHz N018 opamp Aol=100G GBW=100Meg  ; pins invin noninvin out
.model NPN NPN
.model PNP PNP
.lib standard.bjt
.noise V(SR560) V3 dec 100 1 10Meg
.include THAT300.lib
;tran 10m
.OPTIONS plotwinsize=0
.OPTIONS numdgt=15
* Adjust the trimpot for 80dB of gain @ 1kHz
;ac dec 100 1 10Meg
* Note: there is a series resistance in V3
;.TEMP 23.5
;.step param Vbat list 4.5 4
* This is the Norton equivalent
* of a current source with 10 Ohm
* in parallel
* Gain with short @ 1kHz: 10.002681K
* 10.000867K
* Gain with 10R @ 1kHz: 9.7167159K
* Use 9800 for plotting.
* 9.7179192K
.lib opamp.sub
* Simplified SR560 including input impedance and LP filter to limit the bandwidth to 1.1 MHz
.lib LTC2.lib
.backanno
.end